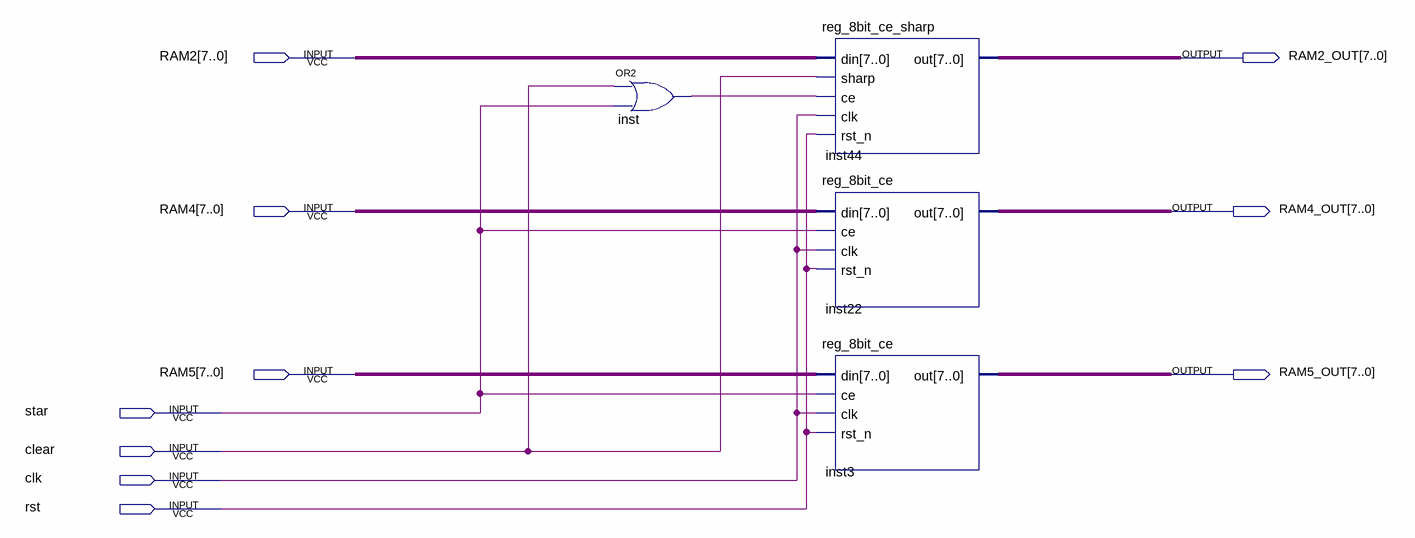
[diagram p0: schematic sheet]
// Quartus schematic RAM_to_CPU.bdf as structural Verilog: 4 symbols, 10 pins
module RAM_to_CPU (
  input  [7:0] RAM2,
  input  [7:0] RAM4,
  input  [7:0] RAM5,
  input  star,
  input  clear,
  input  clk,
  input  rst,
  output [7:0] RAM2_OUT,
  output [7:0] RAM4_OUT,
  output [7:0] RAM5_OUT
);

  wire inst_out;

  or inst (inst_out, clear, star);
  reg_8bit_ce_sharp inst44 (.din(RAM2), .sharp(clear), .ce(inst_out), .clk(clk), .rst_n(rst), .out(RAM2_OUT));
  reg_8bit_ce inst22 (.din(RAM4), .ce(star), .clk(clk), .rst_n(rst), .out(RAM4_OUT));
  reg_8bit_ce inst3 (.din(RAM5), .ce(star), .clk(clk), .rst_n(rst), .out(RAM5_OUT));
endmodule
